# Altium project vehRec.PrjPCB
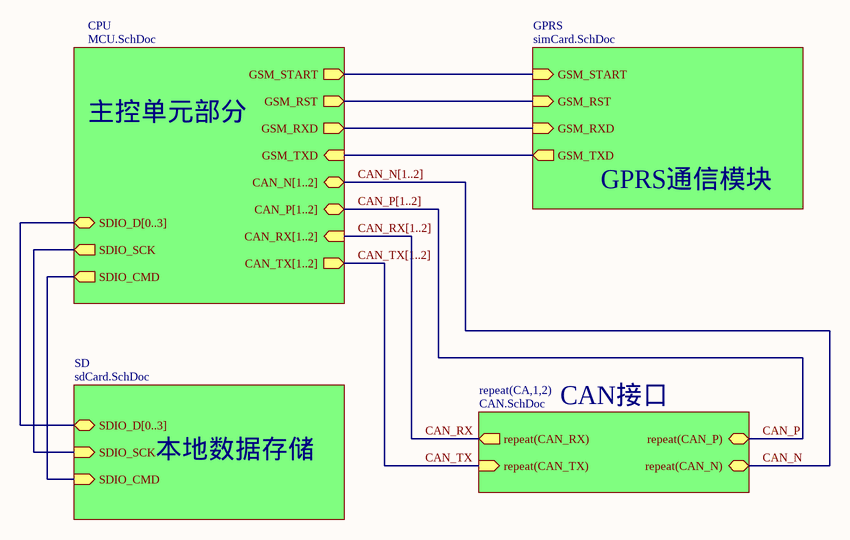
[diagram p0: main.SchDoc]
5 sheets, 122 parts. Net scope: hierarchical (ports join the sheet entries above them; power ports are global).
Board file: vehRec.PcbDoc
Sheets:
  main.SchDoc
    CPU = MCU.SchDoc
    GPRS = simCard.SchDoc
    SD = sdCard.SchDoc
    CA1 = CAN.SchDoc
    CA2 = CAN.SchDoc

## Sheet main.SchDoc
size A4

### Sub-sheets
CPU = MCU.SchDoc: CAN_TX[1..2] (out), CAN_RX[1..2] (in), SDIO_D[0..3] (bidir), SDIO_SCK (out), SDIO_CMD (out), CAN_N[1..2] (bidir), CAN_P[1..2] (bidir), GSM_START (out), GSM_RST (out), GSM_TXD (in), GSM_RXD (out)
GPRS = simCard.SchDoc: GSM_START (in), GSM_RST (in), GSM_RXD (in), GSM_TXD (out)
repeat(CA,1,2) = CAN.SchDoc: repeat(CAN_RX) (out), repeat(CAN_TX) (in), repeat(CAN_P) (bidir), repeat(CAN_N) (bidir)
SD = sdCard.SchDoc: SDIO_D[0..3] (bidir), SDIO_SCK (in), SDIO_CMD (in)

### Nets
CAN_N: sheet repeat(CA,1,2)/repeat(CAN_N)
CAN_P: sheet repeat(CA,1,2)/repeat(CAN_P)
CAN_RX: sheet repeat(CA,1,2)/repeat(CAN_RX)
CAN_TX: sheet repeat(CA,1,2)/repeat(CAN_TX)
GSM_RST: sheet CPU/GSM_RST, sheet GPRS/GSM_RST
GSM_RXD: sheet CPU/GSM_RXD, sheet GPRS/GSM_RXD
GSM_START: sheet CPU/GSM_START, sheet GPRS/GSM_START
GSM_TXD: sheet CPU/GSM_TXD, sheet GPRS/GSM_TXD
PC12: sheet CPU/SDIO_SCK, sheet SD/SDIO_SCK
PD2: sheet CPU/SDIO_CMD, sheet SD/SDIO_CMD

### Buses and harness runs
bus CAN_N[1..2] = sheet CPU/CAN_N[1..2]
bus CAN_P[1..2] = sheet CPU/CAN_P[1..2]
bus CAN_RX[1..2] = sheet CPU/CAN_RX[1..2]
bus CAN_TX[1..2] = sheet CPU/CAN_TX[1..2]
bus sheet CPU/SDIO_D[0..3] = sheet SD/SDIO_D[0..3]

### Notes on the sheet
- 主控单元部分
- GPRS通信模块
- 本地数据存储
- CAN接口

## Sheet MCU.SchDoc
size A3
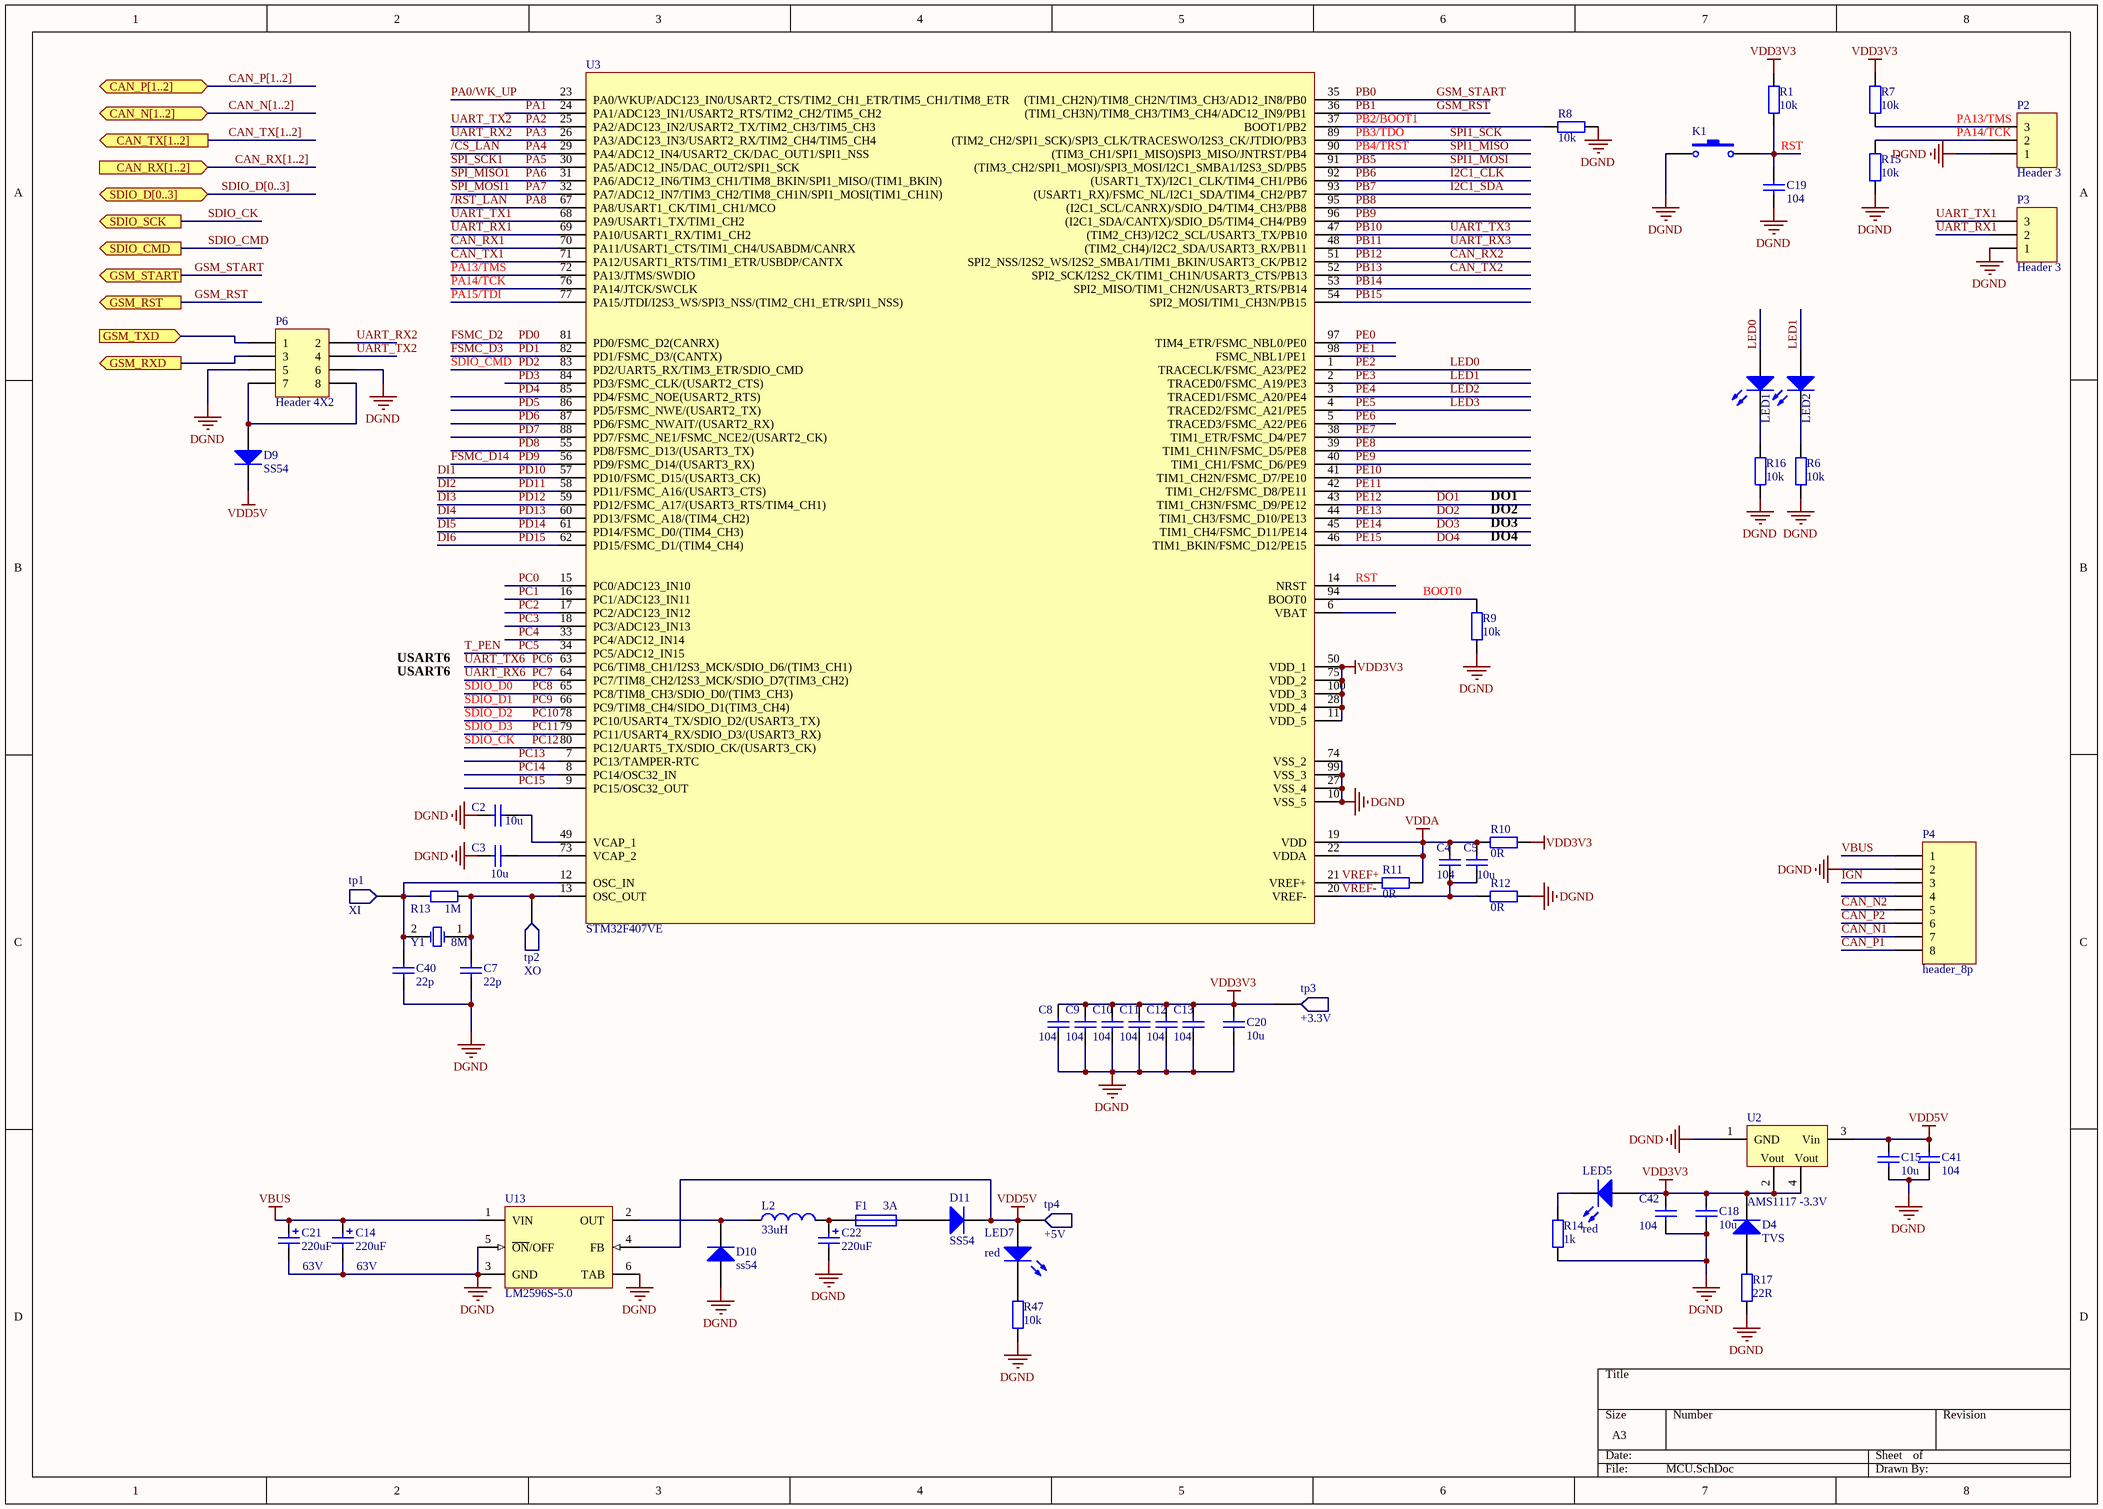
[diagram p1: MCU.SchDoc]

### Parts
C2  10u  [0603_]
C3  10u  [0603_]
C4  104  [0603_]
C5  10u  [0603_]
C7  22p  [0603_]
C8  104  [0603_]
C9  104  [0603_]
C10  104  [0603_]
C11  104  [0603_]
C12  104  [0603_]
C13  104  [0603_]
C14  220uF  VDC_: 63V  [Cap - 10mmx10mm]
C15  10u  [0603_]
C18  10u  [0603_]
C19  104  [0603_]
C20  10u  [0603_]
C21  220uF  VDC_: 63V  [Cap - 10mmx10mm]
C22  220uF  [Cap - 10mmx10mm]
C40  22p  [0603_]
C41  104  [0603_]
C42  104  [0603_]
D4  TVS  [SMB]
D9  SS54  [SMA]
D10  ss54  [SMA]
D11  SS54  [SMA]
F1  3A  [3216]
K1  k  [key-2pin]  (value not drawn)
L2  33uH  [Induct 7*7*4]
LED1  red  [0603_diode]  (value not drawn)
LED2  red  [0603_diode]  (value not drawn)
LED5  red  [0603_diode]
LED7  red  [0603_diode]
P2  Header 3  [HDR1X3]
P3  Header 3  [HDR1X3]
P4  header_8p  [WJ2EDG5.08-8P]
P6  Header 4X2  [HDR2X4]
R1  10k  [0603_]
R6  10k  [0603_]
R7  10k  [0603_]
R8  10k  [0603_]
R9  10k  [0603_]
R10  0R  [0603_]
R11  0R  [0603_]
R12  0R  [0603_]
R13  1M  [0603_]
R14  1k  [0603_]
R15  10k  [0603_]
R16  10k  [0603_]
R17  22R  [0603_]
R47  10k  [0603_]
tp1  XI  [testPoint_s]
tp2  XO  [testPoint_s]
tp3  +3.3V  [testPoint]
tp4  +5V  [testPoint]
U2  AMS1117 -3.3V  [SOT-223]
U3  STM32F407VE  [LQFP100-M]
U13  LM2596S-5.0  [TS5B_N]
Y1  8M  [xtal]

### Ports
CAN_N[1..2] (bidir), CAN_P[1..2] (bidir), CAN_RX[1..2] (in), CAN_TX[1..2] (out), GSM_RST (out), GSM_RXD (out), GSM_START (out), GSM_TXD (in), SDIO_CMD (out), SDIO_D[0..3] (bidir), SDIO_SCK (out)

### Nets
DGND: C2.1 C3.1 C7.1 C8.2 C9.2 C10.2 C11.2 C12.2 C13.2 C14.2 C15.1 C18.1 C19.2 C20.1 C21.2 C22.2 C40.1 C41.2 C42.2 D10.A K1.1 P2.1 P3.1 P4.2 P6.5 P6.6 R6.2 R8.2 R9.2 R12.2 R14.1 R15.2 R16.2 R17.1 R47.2 U2.1(GND) U3.10(VSS_5) U3.27(VSS_4) U3.74(VSS_2) U3.99(VSS_3) U13.3(GND) U13.5(~{ON}/OFF) U13.6(TAB)
VBUS: C14.1 C21.1 P4.1 U13.1(VIN)
VDD3V3: C8.1 C9.1 C10.1 C11.1 C12.1 C13.1 C18.2 C20.2 C42.1 D4.K LED5.1(A) R1.1 R7.1 R10.2 tp3.1 U2.2(Vout) U2.4(Vout) U3.11(VDD_5) U3.28(VDD_4) U3.50(VDD_1) U3.75(VDD_2) U3.100(VDD_3)
VDD5V: C15.2 C41.1 D9.K D11.K LED7.1(A) tp4.1 U2.3(Vin) U13.4(FB)
VDDA: C4.1 C5.1 R10.1 R11.2 U3.19(VDD) U3.22(VDDA)
/CS_LAN: U3.29(PA4/ADC12_IN4/USART2_CK/DAC_OUT1/SPI1_NSS)  [also labelled PA4]
/RST_LAN: U3.67(PA8/USART1_CK/TIM1_CH1/MCO)  [also labelled PA8]
BOOT0: R9.1 U3.94(BOOT0)
CAN_N1: P4.7  [project net CAN_N]
CAN_N2: P4.5  [project net CAN_N]
CAN_P1: P4.8  [project net CAN_P]
CAN_P2: P4.6  [project net CAN_P]
CAN_RX1: U3.70(PA11/USART1_CTS/TIM1_CH4/USABDM/CANRX)
CAN_RX2: U3.51(SPI2_NSS/I2S2_WS/I2S2_SMBA1/TIM1_BKIN/USART3_CK/PB12)  [also labelled PB12]
CAN_TX1: U3.71(PA12/USART1_RTS/TIM1_ETR/USBDP/CANTX)
CAN_TX2: U3.52(SPI2_SCK/I2S2_CK/TIM1_CH1N/USART3_CTS/PB13)  [also labelled PB13]
DI1: U3.57(PD10/FSMC_D15/(USART3_CK))  [also labelled PD10]
DI2: U3.58(PD11/FSMC_A16/(USART3_CTS))  [also labelled PD11]
DI3: U3.59(PD12/FSMC_A17/(USART3_RTS/TIM4_CH1))  [also labelled PD12]
DI4: U3.60(PD13/FSMC_A18/(TIM4_CH2))  [also labelled PD13]
DI5: U3.61(PD14/FSMC_D0/(TIM4_CH3))  [also labelled PD14]
DI6: U3.62(PD15/FSMC_D1/(TIM4_CH4))  [also labelled PD15]
DO1: U3.43(TIM1_CH3N/FSMC_D9/PE12)  [also labelled PE12]
DO2: U3.44(TIM1_CH3/FSMC_D10/PE13)  [also labelled PE13]
DO3: U3.45(TIM1_CH4/FSMC_D11/PE14)  [also labelled PE14]
DO4: U3.46(TIM1_BKIN/FSMC_D12/PE15)  [also labelled PE15]
FSMC_D2: U3.81(PD0/FSMC_D2(CANRX))  [also labelled PD0]
FSMC_D3: U3.82(PD1/FSMC_D3/(CANTX))  [also labelled PD1]
FSMC_D14: U3.56(PD9/FSMC_D14/(USART3_RX))  [also labelled PD9]
GSM_RST: U3.36((TIM1_CH3N)/TIM8_CH3/TIM3_CH4/ADC12_IN9/PB1) ; port GSM_RST  [also labelled PB1]
GSM_RXD: P6.3 ; port GSM_RXD
GSM_START: U3.35((TIM1_CH2N)/TIM8_CH2N/TIM3_CH3/AD12_IN8/PB0) ; port GSM_START  [also labelled PB0]
GSM_TXD: P6.1 ; port GSM_TXD
I2C1_CLK: U3.92((USART1_TX)/I2C1_CLK/TIM4_CH1/PB6)  [also labelled PB6]
I2C1_SDA: U3.93((USART1_RX)/FSMC_NL/I2C1_SDA/TIM4_CH2/PB7)  [also labelled PB7]
IGN: P4.3
LED0: LED1.1(A) U3.1(TRACECLK/FSMC_A23/PE2)  [also labelled PE2]
LED1: LED2.1(A) U3.2(TRACED0/FSMC_A19/PE3)  [also labelled PE3]
LED2: U3.3(TRACED1/FSMC_A20/PE4)  [also labelled PE4]
LED3: U3.4(TRACED2/FSMC_A21/PE5)  [also labelled PE5]
PA0/WK_UP: U3.23(PA0/WKUP/ADC123_IN0/USART2_CTS/TIM2_CH1_ETR/TIM5_CH1/TIM8_ETR)
PA1: U3.24(PA1/ADC123_IN1/USART2_RTS/TIM2_CH2/TIM5_CH2)
PA2: P6.4 U3.25(PA2/ADC123_IN2/USART2_TX/TIM2_CH3/TIM5_CH3)  [also labelled UART_TX2]
PA3: P6.2 U3.26(PA3/ADC123_IN3/USART2_RX/TIM2_CH4/TIM5_CH4)  [also labelled UART_RX2]
PA5: U3.30(PA5/ADC12_IN5/DAC_OUT2/SPI1_SCK)  [also labelled SPI_SCK1]
PA6: U3.31(PA6/ADC12_IN6/TIM3_CH1/TIM8_BKIN/SPI1_MISO/(TIM1_BKIN))  [also labelled SPI_MISO1]
PA7: U3.32(PA7/ADC12_IN7/TIM3_CH2/TIM8_CH1N/SPI1_MOSI(TIM1_CH1N))  [also labelled SPI_MOSI1]
PA13/TMS: P2.3 R7.2 U3.72(PA13/JTMS/SWDIO)
PA14/TCK: P2.2 R15.1 U3.76(PA14/JTCK/SWCLK)
PA15/TDI: U3.77(PA15/JTDI/I2S3_WS/SPI3_NSS/(TIM2_CH1_ETR/SPI1_NSS))
PB2/BOOT1: R8.1 U3.37(BOOT1/PB2)
PB3/TDO: U3.89((TIM2_CH2/SPI1_SCK)/SPI3_CLK/TRACESWO/I2S3_CK/JTDIO/PB3)  [also labelled SPI1_SCK]
PB4/TRST: U3.90((TIM3_CH1/SPI1_MISO)SPI3_MISO/JNTRST/PB4)  [also labelled SPI1_MISO]
PB5: U3.91((TIM3_CH2/SPI1_MOSI)/SPI3_MOSI/I2C1_SMBA1/I2S3_SD/PB5)  [also labelled SPI1_MOSI]
PB8: U3.95((I2C1_SCL/CANRX)/SDIO_D4/TIM4_CH3/PB8)
PB9: U3.96((I2C1_SDA/CANTX)/SDIO_D5/TIM4_CH4/PB9)
PB10: U3.47((TIM2_CH3)/I2C2_SCL/USART3_TX/PB10)  [also labelled UART_TX3]
PB11: U3.48((TIM2_CH4)/I2C2_SDA/USART3_RX/PB11)  [also labelled UART_RX3]
PB14: U3.53(SPI2_MISO/TIM1_CH2N/USART3_RTS/PB14)
PB15: U3.54(SPI2_MOSI/TIM1_CH3N/PB15)
PC0: U3.15(PC0/ADC123_IN10)
PC1: U3.16(PC1/ADC123_IN11)
PC2: U3.17(PC2/ADC123_IN12)
PC3: U3.18(PC3/ADC123_IN13)
PC4: U3.33(PC4/ADC12_IN14)
PC5: U3.34(PC5/ADC12_IN15)  [also labelled T_PEN]
PC6: U3.63(PC6/TIM8_CH1/I2S3_MCK/SDIO_D6/(TIM3_CH1))  [also labelled UART_TX6]
PC7: U3.64(PC7/TIM8_CH2/I2S3_MCK/SDIO_D7(TIM3_CH2))  [also labelled UART_RX6]
PC8: U3.65(PC8/TIM8_CH3/SDIO_D0/(TIM3_CH3))  [also labelled SDIO_D0]
PC9: U3.66(PC9/TIM8_CH4/SIDO_D1(TIM3_CH4))  [also labelled SDIO_D1]
PC10: U3.78(PC10/USART4_TX/SDIO_D2/(USART3_TX))  [also labelled SDIO_D2]
PC11: U3.79(PC11/USART4_RX/SDIO_D3/(USART3_RX))  [also labelled SDIO_D3]
PC12: U3.80(PC12/UART5_TX/SDIO_CK/(USART3_CK)) ; port SDIO_SCK  [also labelled SDIO_CK]
PC13: U3.7(PC13/TAMPER-RTC)
PC14: U3.8(PC14/OSC32_IN)
PC15: U3.9(PC15/OSC32_OUT)
PD2: U3.83(PD2/UART5_RX/TIM3_ETR/SDIO_CMD) ; port SDIO_CMD  [also labelled SDIO_CMD]
PD3: U3.84(PD3/FSMC_CLK/(USART2_CTS))
PD4: U3.85(PD4/FSMC_NOE(USART2_RTS))
PD5: U3.86(PD5/FSMC_NWE/(USART2_TX))
PD6: U3.87(PD6/FSMC_NWAIT/(USART2_RX))
PD7: U3.88(PD7/FSMC_NE1/FSMC_NCE2/(USART2_CK))
PD8: U3.55(PD8/FSMC_D13/(USART3_TX))
PE0: U3.97(TIM4_ETR/FSMC_NBL0/PE0)
PE1: U3.98(FSMC_NBL1/PE1)
PE6: U3.5(TRACED3/FSMC_A22/PE6)
PE7: U3.38(TIM1_ETR/FSMC_D4/PE7)
PE8: U3.39(TIM1_CH1N/FSMC_D5/PE8)
PE9: U3.40(TIM1_CH1/FSMC_D6/PE9)
PE10: U3.41(TIM1_CH2N/FSMC_D7/PE10)
PE11: U3.42(TIM1_CH2/FSMC_D8/PE11)
RST: C19.1 K1.2 R1.2 U3.14(NRST)
UART_RX1: P3.2 U3.69(PA10/USART1_RX/TIM1_CH2)
UART_TX1: P3.3 U3.68(PA9/USART1_TX/TIM1_CH2)
VREF+: R11.1 U3.21(VREF+)
VREF-: C4.2 C5.2 R12.1 U3.20(VREF-)
NetC2_2: C2.2 U3.49(VCAP_1)
NetC3_2: C3.2 U3.73(VCAP_2)
NetC7_2: C7.2 R13.1 tp2.1 U3.13(OSC_OUT) Y1.1(OSC1)
NetC22_1: C22.1 F1.1 L2.2
NetC40_2: C40.2 R13.2 tp1.1 U3.12(OSC_IN) Y1.2(OSC2)
NetD4_A: D4.A R17.2
NetD9_A: D9.A P6.7 P6.8
NetD10_K: D10.K L2.1 U13.2(OUT)
NetD11_A: D11.A F1.2
NetLED1_2: LED1.2(K) R16.1
NetLED2_2: LED2.2(K) R6.1
NetLED5_2: LED5.2(K) R14.2
NetLED7_2: LED7.2(K) R47.1

Not connected (* = marked no-connect by the designer): P4 4; U3 6(VBAT)

### Buses and harness runs
bus CAN_N[1..2] = port CAN_N[1..2]
bus CAN_P[1..2] = port CAN_P[1..2]
bus CAN_RX[1..2] = port CAN_RX[1..2]
bus CAN_TX[1..2] = port CAN_TX[1..2]
bus SDIO_D[0..3] = port SDIO_D[0..3]

### Notes on the sheet
- DO1
- DO2
- DO3
- DO4
- USART6

### Library data of the parts
C2-C5 C7-C13 C15 C18-C20 C40-C42 = cap: VDC_V: 16V; Tolerance_: ±10%
C14 C21 = cap-pol: Tolerance_: ±10%
C22 = cap-pol: VDC_: 16V; Tolerance_: ±10%
D4 D9-D11 = diode
F1 = FUSE
K1 = SW
L2 = inductor: Current_: ?A
LED1 LED2 LED5 LED7 = led
P2 P3 = Header 3: Header, 3-Pin; LatestRevisionDate: 17-Jul-2002; LatestRevisionNote: Re-released for DXP Platform.; Publisher: Altium Limited
P4 = header_8p: Pheonix Connector
P6 = Header 4X2: Header, 4-Pin, Dual row; LatestRevisionDate: 17-Jul-2002; LatestRevisionNote: Re-released for DXP Platform.; Publisher: Altium Limited
R1 R6 R7 R9-R16 = res: Tolerance_: ±5%; Power_W: 1/16W
R8 = res: Tolerance_: ±5%
R17 R47 = res: Tolerance_: ±5%; Power_: ?W
tp1-tp4 = pad
U2 = AMS1117
U13 = LM2596S-3.3: SIMPLE SWITCHER Power Converter 150 KHz 3A Step-Down Voltage Regulator; Manufacturer: National Semiconductor; PackageTopMarking: NSUZXYTT*LM2596S*-3.3 P+; Published: 27-Nov-2008; DatasheetVersion: May-2002; PackageVersion: revD, Apr-2005; PackageReference: TS5B; Publisher: Altium Limited; PackageDescription: TO-263, Molded, .400 x .390 x .180in, 5 Lead, .067in Pitch, Surface Mount; CompType: Switcher; PartNumber: LM2596S-3.3; RoHS: O; PinCount: 5; DigiKeyPartNumber: LM2596S-3.3-ND; Code_JEDEC: MO-169-AB; ComponentLink1Description: LM2596 Datasheet; ComponentLink1URL: http://www.national.com/ds/LM/LM2596.pdf; ComponentLink2Description: LM2596 Web Page; ComponentLink2URL: http://www.national.com/pf/LM/LM2596.html; ComponentLink3Description: TS5B Package Page; ComponentLink3URL: http://www.national.com/packaging/folders/ts5b.html
Y1 = xtal

## Sheet simCard.SchDoc
size A4
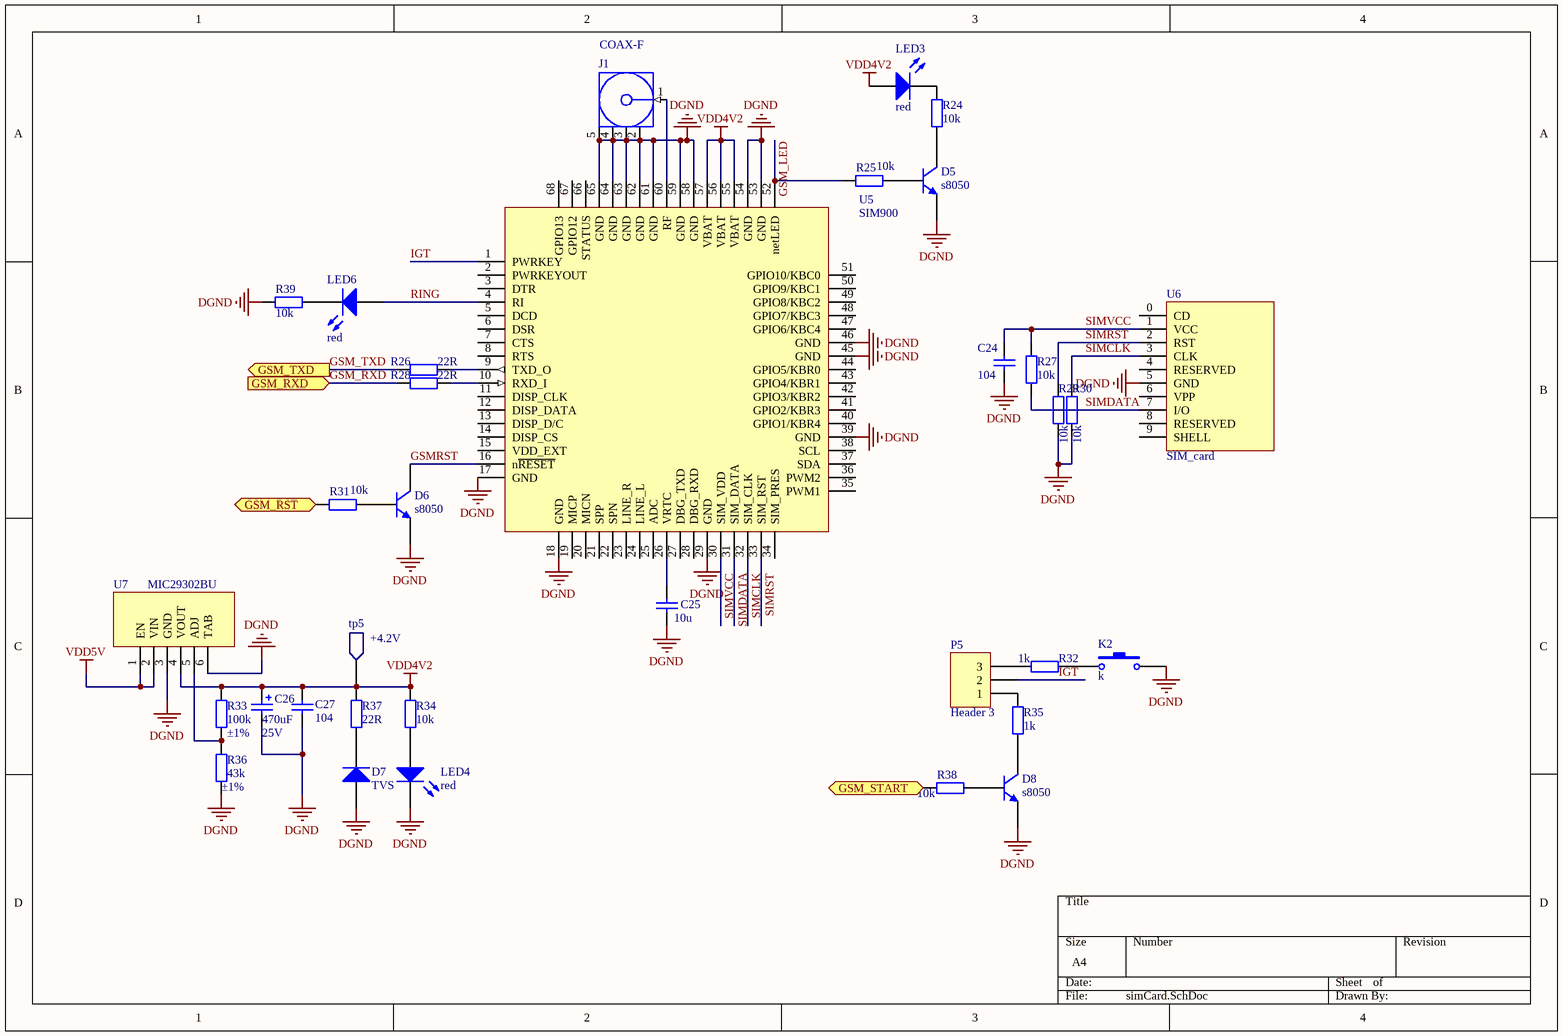
[diagram p2: simCard.SchDoc]

### Parts
C24  104  [0603_]
C25  10u  [0603_]
C26  470uF  VDC_: 25V  [Cap - 10mmx10mm]
C27  104  [0603_]
D5  s8050  [SOT-23(bce)]
D6  s8050  [SOT-23(bce)]
D7  TVS  [SMB]
D8  s8050  [SOT-23(bce)]
J1  COAX-F  [MCX5.08-H5]
K2  k  [key-2pin]
LED3  red  [0603_diode]
LED4  red  [0603_diode]
LED6  red  [0603_diode]
P5  Header 3  [HDR1X3]
R24  10k  [0603_]
R25  10k  [0603_]
R26  22R  [0603_]
R27  10k  [0603_]
R28  22R  [0603_]
R29  10k  [0603_]
R30  10k  [0603_]
R31  10k  [0603_]
R32  1k  [0603_]
R33  100k  Tolerance_: ±1%  [0603_]
R34  10k  [0603_]
R35  1k  [0603_]
R36  43k  Tolerance_: ±1%  [0603_]
R37  22R  [0603_]
R38  10k  [0603_]
R39  10k  [0603_]
tp5  +4.2V  [testPoint]
U5  SIM900  [SIM900]
U6  SIM_card  [SIM_Card]
U7  MIC29302BU  [TO-263(S)]

### Ports
GSM_RST (in), GSM_RXD (in), GSM_START (in), GSM_TXD (out)

### Nets
DGND: C24.1 C25.1 C26.2 C27.1 D5.e(E) D6.e(E) D7.A D8.e(E) J1.2(GND) J1.3(GND) J1.4(GND) J1.5(GND) K2.2 LED4.2(K) R29.1 R30.1 R36.1 R39.1 U5.17(GND) U5.18(GND) U5.29(GND) U5.39(GND) U5.45(GND) U5.46(GND) U5.53(GND) U5.54(GND) U5.58(GND) U5.59(GND) U5.61(GND) U5.62(GND) U5.63(GND) U5.64(GND) U5.65(GND) U6.5(GND) U7.3(GND) U7.6(TAB)
VDD4V2: C26.1 C27.2 LED3.1(A) R33.2 R34.2 R37.2 tp5.1 U5.55(VBAT) U5.56(VBAT) U5.57(VBAT) U7.4(VOUT)
VDD5V: U7.1(EN) U7.2(VIN)
GSM_LED: R25.2 U5.52(netLED)
GSM_RST: R31.2 ; port GSM_RST
GSM_RXD: R28.1 ; port GSM_RXD
GSM_START: R38.2 ; port GSM_START
GSM_TXD: R26.1 ; port GSM_TXD
GSMRST: D6.c(C) U5.16(n~{RESET})
IGT: P5.2 U5.1(PWRKEY)
RING: LED6.1(A) U5.4(RI)
SIMCLK: R30.2 U5.32(SIM_CLK) U6.3(CLK)
SIMDATA: R27.1 U5.31(SIM_DATA) U6.7(I/O)
SIMRST: R29.2 U5.33(SIM_RST) U6.2(RST)
SIMVCC: C24.2 R27.2 U5.30(SIM_VDD) U6.1(VCC)
NetC25_2: C25.2 U5.26(VRTC)
NetD5_b: D5.b(B) R25.1
NetD5_c: D5.c(C) R24.1
NetD6_b: D6.b(B) R31.1
NetD7_K: D7.K R37.1
NetD8_b: D8.b(B) R38.1
NetD8_c: D8.c(C) R35.1
NetJ1_1: J1.1(Signal) U5.60(RF)
NetK2_1: K2.1 R32.1
NetLED3_2: LED3.2(K) R24.2
NetLED4_1: LED4.1(A) R34.1
NetLED6_2: LED6.2(K) R39.2
NetP5_1: P5.1 R35.2
NetP5_3: P5.3 R32.2
NetR26_2: R26.2 U5.9(TXD_O)
NetR28_2: R28.2 U5.10(RXD_I)
NetR33_1: R33.1 R36.2 U7.5(ADJ)

Not connected (* = marked no-connect by the designer): U5 2(PWRKEYOUT) 3(DTR) 5(DCD) 6(DSR) 7(CTS) 8(RTS) 11(DISP_CLK) 12(DISP_DATA) 13(DISP_D/C) 14(DISP_CS) 15(VDD_EXT) 19(MICP) 20(MICN) 21(SPP) 22(SPN) 23(LINE_R) 24(LINE_L) 25(ADC) 27(DBG_TXD) 28(DBG_RXD) 34(SIM_PRES) 35(PWM1) 36(PWM2) 37(SDA) 38(SCL) 40(GPIO1/KBR4) 41(GPIO2/KBR3) 42(GPIO3/KBR2) 43(GPIO4/KBR1) 44(GPIO5/KBR0) 47(GPIO6/KBC4) 48(GPIO7/KBC3) 49(GPIO8/KBC2) 50(GPIO9/KBC1) 51(GPIO10/KBC0) 66(STATUS) 67(GPIO12) 68(GPIO13); U6 0(CD) 4(RESERVED) 6(VPP) 8(RESERVED) 9(SHELL)

### Library data of the parts
C24 C25 C27 = cap: VDC_: 16V; Tolerance_: ±10%
C26 = cap-pol: Tolerance_: ±10%
D5 D6 D8 = NPN
D7 = diode
J1 = COAX-F: RF Coaxial PCB Connector, MCX; Thru-Hole, Right-Angle Mount Socket, Blunt Post Terminal, 50 Ohm Impedance; PCB_Layout: Complies with manufacturer's recommendation.; DrillSize: Corresponds to nominal value.; Published: 15-Jul-2004; LatestRevisionDate: 15-Jul-2004; LatestRevisionNote: Component Replaced.; DatasheetDocument: 30-May-2003; PackageDocument: 04-Jul-1999; PackageReference: 919-119J-51AX; Publisher: Altium Limited; ComponentLink1Description: Manufacturer Link; ComponentLink1URL: http://www.amphenolrf.com/
K2 = SW
LED3 LED4 LED6 = led
P5 = Header 3: Header, 3-Pin; LatestRevisionDate: 17-Jul-2002; LatestRevisionNote: Re-released for DXP Platform.; Publisher: Altium Limited
R24-R32 R34 R35 R37-R39 = res: Tolerance_: ±5%; Power_: ?W
R33 R36 = res: Power_: ?W
tp5 = pad

## Sheet sdCard.SchDoc
size A4
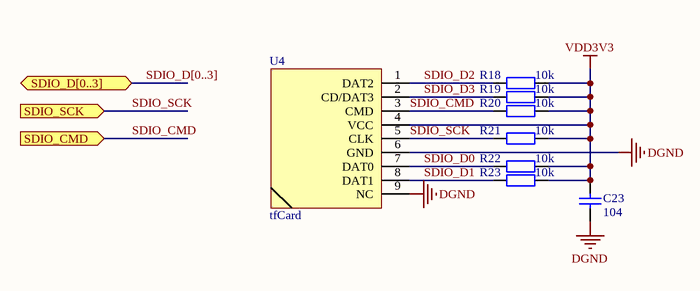
[diagram p3: sdCard.SchDoc]

### Parts
C23  104  [0603_]
R18  10k  [0603_]
R19  10k  [0603_]
R20  10k  [0603_]
R21  10k  [0603_]
R22  10k  [0603_]
R23  10k  [0603_]
U4  tfCard  [tfCard]

### Ports
SDIO_CMD (in), SDIO_D[0..3] (bidir), SDIO_SCK (in)

### Nets
DGND: C23.1 U4.6(GND) U4.9(NC)
VDD3V3: C23.2 R18.2 R19.2 R20.2 R21.2 R22.2 R23.2 U4.4(VCC)
SDIO_CMD: R20.1 U4.3(CMD) ; port SDIO_CMD  [project net PD2]
SDIO_D0: R22.1 U4.7(DAT0)  [project net PC8]
SDIO_D1: R23.1 U4.8(DAT1)  [project net PC9]
SDIO_D2: R18.1 U4.1(DAT2)  [project net PC10]
SDIO_D3: R19.1 U4.2(CD/DAT3)  [project net PC11]
SDIO_SCK: R21.1 U4.5(CLK) ; port SDIO_SCK  [project net PC12]

### Buses and harness runs
bus SDIO_D[0..3] = port SDIO_D[0..3]

### Library data of the parts
C23 = cap: VDC_: 16V; Tolerance_: ±10%
R18-R23 = res: Tolerance_: ±5%; Power_: ?W

## Sheet CAN.SchDoc
size A4
Used 2 times, as channels CA1, CA2. Parts and nets are listed once, with the designators drawn on the sheet.
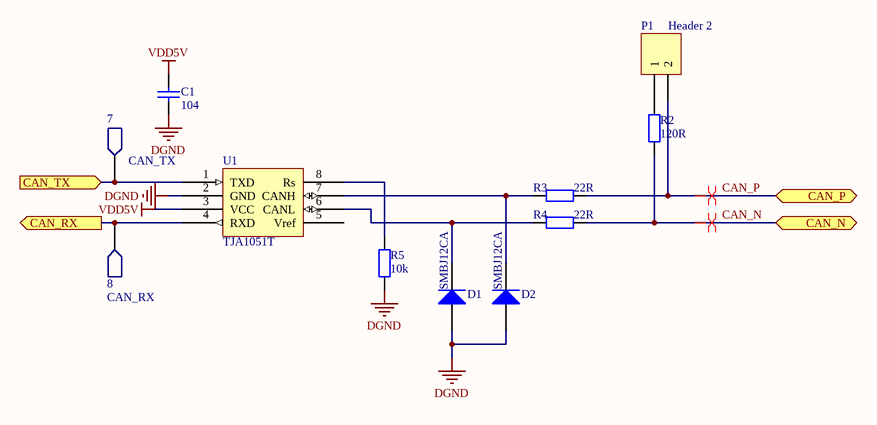
[diagram p4: CAN.SchDoc]

### Parts
7  CAN_TX  [testPoint]
8  CAN_RX  [testPoint]
C1  104  [0603_]
D1  SMBJ12CA  [SMB]
D2  SMBJ12CA  [SMB]
P1  Header 2  [HDR1X2]
R2  120R  [0603_]
R3  22R  [0603_]
R4  22R  [0603_]
R5  10k  [0603_]
U1  TJA1051T  [SOP8]

### Ports
CAN_N (bidir), CAN_P (bidir), CAN_RX (out), CAN_TX (in)

### Nets
DGND: C1.1 D1.A D2.A R5.1 U1.2(GND)
VDD5V: C1.2 U1.3(VCC)
CAN_N: R2.1 R4.1 ; port CAN_N
CAN_P: P1.2 R3.1 ; port CAN_P
CAN_RX: 8.1 U1.4(RXD) ; port CAN_RX
CAN_TX: 7.1 U1.1(TXD) ; port CAN_TX
NetD1_K: D1.K R4.2 U1.6(CANL)
NetD2_K: D2.K R3.2 U1.7(CANH)
NetP1_1: P1.1 R2.2
NetR5_2: R5.2 U1.8(Rs)

Not connected (* = marked no-connect by the designer): U1 5(Vref)

### Channels
CA1: designators end in _CA1; ports CAN_N=CAN_N CAN_P=CAN_P CAN_RX=CAN_RX1 CAN_TX=CAN_TX1
CA2: designators end in _CA2; ports CAN_N=CAN_N CAN_P=CAN_P CAN_RX=CAN_RX2 CAN_TX=CAN_TX2

### Layout directives
differential pair: CAN_N, CAN_P

### Library data of the parts
7 8 = pad
C1 = cap: VDC_: 16V; Tolerance_: ±10%
D1 D2 = diode
P1 = Header 2: Header, 2-Pin; LatestRevisionDate: 17-Jul-2002; LatestRevisionNote: Re-released for DXP Platform.; Publisher: Altium Limited
R2-R5 = res: Tolerance_: ±5%; Power_: ?W
U1 = PCA82C250Y

## Nets that join several sheets
DGND: MCU (43 pins), simCard (36 pins), sdCard (C23.1 U4.6 U4.9), CA1 (5 pins), CA2 (5 pins)
VDD3V3: MCU (22 pins), sdCard (8 pins)
VDD5V: MCU (8 pins), simCard (U7.1 U7.2), CA1 (C1_CA1.2 U1_CA1.3), CA2 (C1_CA2.2 U1_CA2.3)
CAN_N: MCU (P4.5), CA2 (R2_CA2.1 R4_CA2.1)
CAN_N: MCU (P4.7), CA1 (R2_CA1.1 R4_CA1.1)
CAN_P: MCU (P4.6), CA2 (P1_CA2.2 R3_CA2.1)
CAN_P: MCU (P4.8), CA1 (P1_CA1.2 R3_CA1.1)
CAN_RX1: MCU (U3.70), CA1 (8_CA1.1 U1_CA1.4)
CAN_RX2: MCU (U3.51), CA2 (8_CA2.1 U1_CA2.4)
CAN_TX1: MCU (U3.71), CA1 (7_CA1.1 U1_CA1.1)
CAN_TX2: MCU (U3.52), CA2 (7_CA2.1 U1_CA2.1)
GSM_RST: MCU (U3.36), simCard (R31.2)
GSM_RXD: MCU (P6.3), simCard (R28.1)
GSM_START: MCU (U3.35), simCard (R38.2)
GSM_TXD: MCU (P6.1), simCard (R26.1)
PC8: MCU (U3.65), sdCard (R22.1 U4.7)
PC9: MCU (U3.66), sdCard (R23.1 U4.8)
PC10: MCU (U3.78), sdCard (R18.1 U4.1)
PC11: MCU (U3.79), sdCard (R19.1 U4.2)
PC12: MCU (U3.80), sdCard (R21.1 U4.5)
PD2: MCU (U3.83), sdCard (R20.1 U4.3)